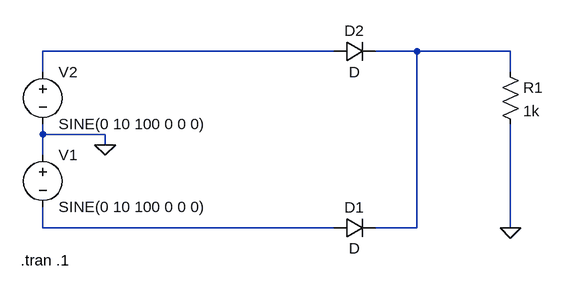
[diagram p0: schematic puntoMedio.asc]
puntoMedio.asc, the LTspice schematic file:
Version 4
SHEET 1 880 680
WIRE 320 96 -128 96
WIRE 448 96 384 96
WIRE 592 96 448 96
WIRE -128 128 -128 96
WIRE 592 128 592 96
WIRE -128 224 -128 208
WIRE -32 224 -128 224
WIRE -32 240 -32 224
WIRE -128 256 -128 224
WIRE -128 368 -128 336
WIRE 320 368 -128 368
WIRE 448 368 448 96
WIRE 448 368 384 368
WIRE 592 368 592 208
FLAG -32 240 0
FLAG 592 368 0
SYMBOL voltage -128 240 R0
WINDOW 123 0 0 Left 0
WINDOW 39 0 0 Left 0
SYMATTR InstName V1
SYMATTR Value SINE(0 10 100 0 0 0)
SYMBOL voltage -128 112 R0
WINDOW 123 0 0 Left 0
WINDOW 39 0 0 Left 0
SYMATTR InstName V2
SYMATTR Value SINE(0 10 100 0 0 0)
SYMBOL diode 320 384 R270
WINDOW 0 32 32 VTop 2
WINDOW 3 0 32 VBottom 2
SYMATTR InstName D1
SYMBOL diode 320 112 R270
WINDOW 0 32 32 VTop 2
WINDOW 3 0 32 VBottom 2
SYMATTR InstName D2
SYMBOL res 576 112 R0
SYMATTR InstName R1
SYMATTR Value 1k
TEXT -162 418 Left 2 !.tran .1

The netlist it stands for:
* puntoMedio.asc
V1 0 N003 SINE(0 10 100 0 0 0)
V2 N001 0 SINE(0 10 100 0 0 0)
D1 N003 N002 D
D2 N001 N002 D
R1 N002 0 1k
.model D D
.lib standard.dio
.tran .1
.backanno
.end